# EAGLE design humanoid-18 (EAGLE 7.2.0)

## Sheet 1 of 10
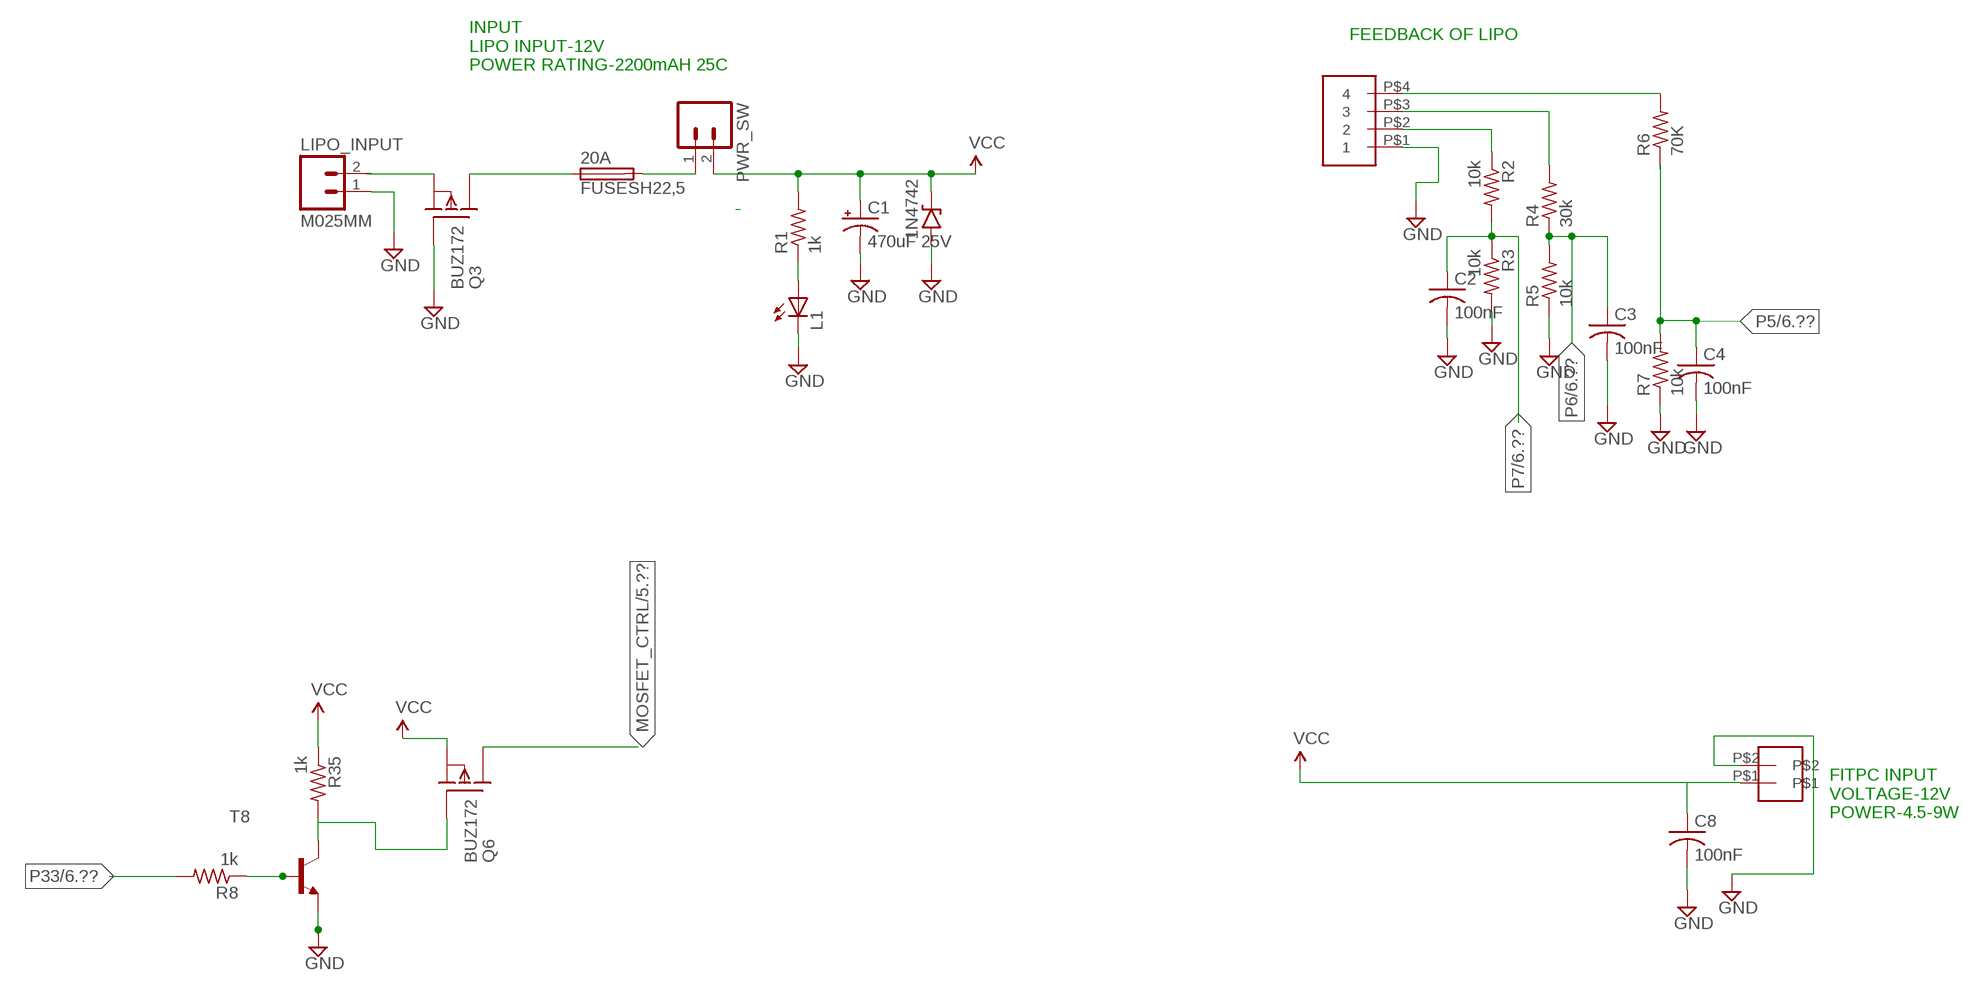
[diagram p0: schematic, sheet 1]

### Parts
1N4742  1N47XX3  [DO41-3]
20A  FUSESH22,5  [SH22,5]
C1  470uF 25V  CPOL-USG  [PANASONIC_G]
C2  100nF  C-USC1206  [C1206]
C3  100nF  C-USC1206  [C1206]
C4  100nF  C-USC1206  [C1206]
C8  100nF  C-USC1206  [C1206]
FITPC  2PINRIGHT  [2PINRIGHT]
L1  LEDCHIPLED_1206  [CHIPLED_1206]
LIPO_FB  4PINRIGHT  [4PINRIGHT]
LIPO_INPUT  M025MM  [SCREWTERMINAL-5MM-2]
PWR_SW  M02PTH  [1X02]
Q3  BUZ172  [TO220]
Q6  BUZ172  [TO220]
R1  1k  R-US_R0805  [R0805]
R2  10k  R-US_R0805  [R0805]
R3  10k  R-US_R0805  [R0805]
R4  30k  R-US_R0805  [R0805]
R5  10k  R-US_R0805  [R0805]
R6  70K  R-US_R0805  [R0805]
R7  10k  R-US_R0805  [R0805]
R8  1k  R-US_R0805  [R0805]
R35  1k  R-US_R0805  [R0805]
T8  MMBT2222ALT1-NPN-SOT23-BEC  [SOT23-BEC]

### Nets
GND: 1N4742.A C1.- C2.2 C3.2 C4.2 C8.2 FITPC.P$2 L1.C LIPO_FB.P$1 LIPO_INPUT.1 Q3.1(G) R3.2 R5.1 R7.1 ; also sheet 2,3,5,6,7,8,10
LIPO_FB4: LIPO_FB.P$4 R6.2
MOSFET_CTRL: Q6.2(D) ; also sheet 5
N$4: LIPO_FB.P$2 R2.1
N$9: 20A.2 PWR_SW.1
N$10: 20A.1 Q3.2(D)
N$18: LIPO_INPUT.2 Q3.3(S)
N$19: Q6.1(G) R35.2 T8.C
N$23: T8.E ; supply symbol labelled GND
N$28: R8.1 T8.B
N$338: LIPO_FB.P$3 R4.2
N$381: L1.A R1.1
P5: C4.1 R6.1 R7.2 ; also sheet 6
P6: C3.1 R4.1 R5.2 ; also sheet 6
P7: C2.1 R2.2 R3.1 ; also sheet 6
P33: R8.2 ; also sheet 6
VCC: 1N4742.C C1.+ C8.1 FITPC.P$1 PWR_SW.2 Q6.3(S) R1.2 R35.1 ; also sheet 3

### Notes on the sheet
- FEEDBACK OF LIPO
- INPUT
  LIPO INPUT-12V
  POWER RATING-2200mAH 25C
- FITPC INPUT
  VOLTAGE-12V
  POWER-4.5-9W

## Sheet 2 of 10
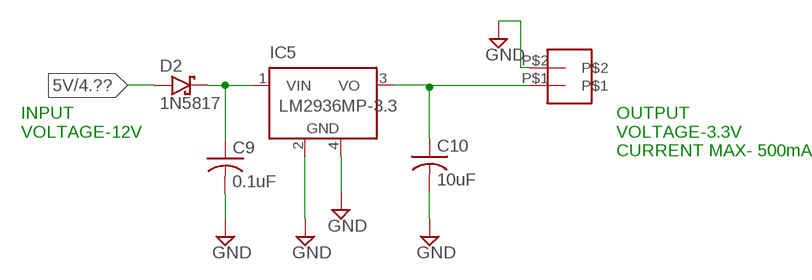
[diagram p1: schematic, sheet 2]

### Parts
3.3V1  2PINRIGHT  [2PINRIGHT]
C9  0.1uF  C-USC1206  [C1206]
C10  10uF  C-USC1206  [C1206]
D2  1N5817  [DO41-3]
IC5  LM2936MP-3.3  [SOT223]

### Nets
3.3V: 3.3V1.P$1 C10.1 IC5.3(VO) ; also sheet 4,6,7,10
5V: D2.A ; also sheet 3,4,6,7,8
GND: 3.3V1.P$2 C9.2 C10.2 IC5.2(GND) IC5.4(GND) ; also sheet 1,3,5,6,7,8,10
N$3: C9.1 D2.C IC5.1(VIN)

### Notes on the sheet
- INPUT
  VOLTAGE-12V
- OUTPUT
  VOLTAGE-3.3V
  CURRENT MAX- 500mA

## Sheet 3 of 10
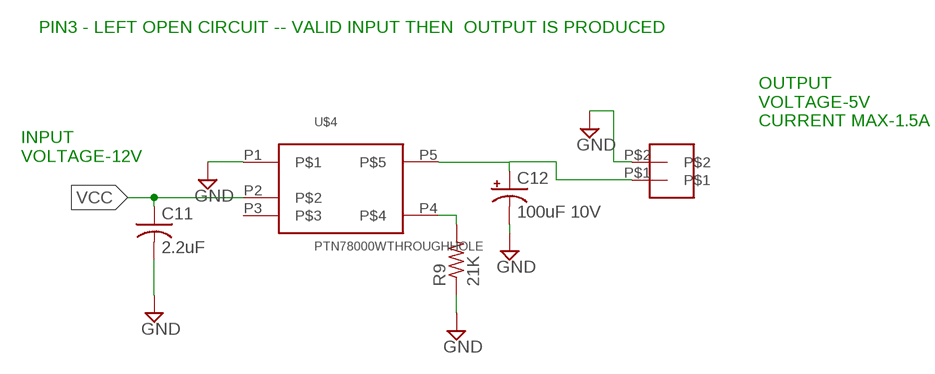
[diagram p2: schematic, sheet 3]

### Parts
5V1  2PINRIGHT  [2PINRIGHT]
C11  2.2uF  C-USC1206  [C1206]
C12  100uF 10V  CPOL-USC  [PANASONIC_C]
R9  21K  R-US_R0805  [R0805]
U$4  PTN78000WTHROUGHHOLE  [PTN78000W]

### Nets
5V: 5V1.P$1 C12.+ U$4.P5 ; also sheet 2,4,6,7,8
GND: 5V1.P$2 C11.2 C12.- R9.1 U$4.P1 ; also sheet 1,2,5,6,7,8,10
N$76: R9.2 U$4.P4
VCC: C11.1 U$4.P2 ; also sheet 1
Unconnected: U$4.P3

### Notes on the sheet
- PIN3 - LEFT OPEN CIRCUIT -- VALID INPUT THEN  OUTPUT IS PRODUCED
- OUTPUT
  VOLTAGE-5V
  CURRENT MAX-1.5A
- INPUT
  VOLTAGE-12V

## Sheet 4 of 10
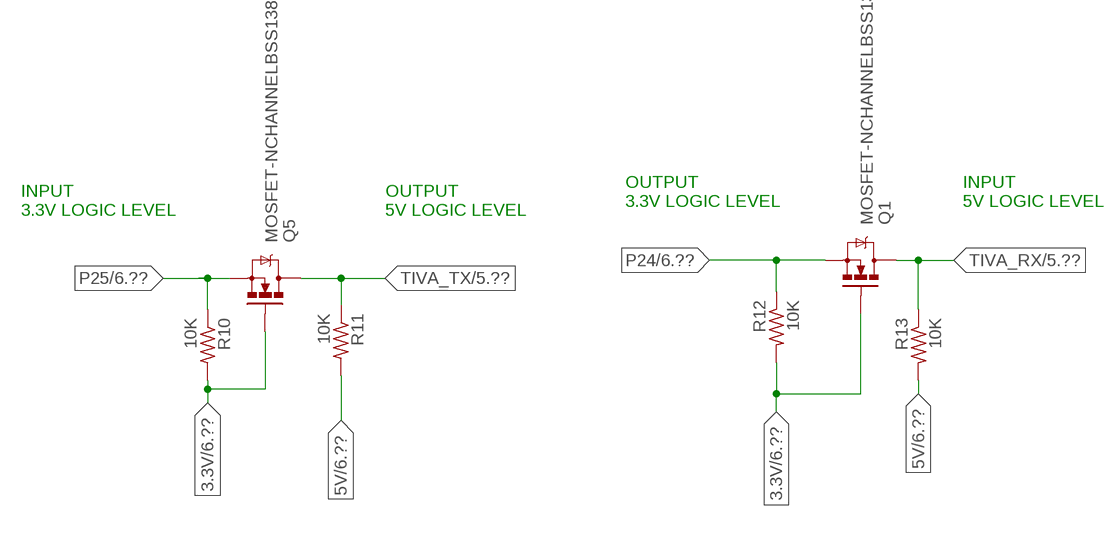
[diagram p3: schematic, sheet 4]

### Parts
Q1  MOSFET-NCHANNELBSS138  [SOT23]
Q5  MOSFET-NCHANNELBSS138  [SOT23]
R10  10K  R-US_R0805  [R0805]
R11  10K  R-US_R0805  [R0805]
R12  10K  R-US_R0805  [R0805]
R13  10K  R-US_R0805  [R0805]

### Nets
3.3V: Q1.1(G) Q5.1(G) R10.2 R12.2 ; also sheet 2,6,7,10
5V: R11.2 R13.2 ; also sheet 2,3,6,7,8
P24: Q1.2(S) R12.1 ; also sheet 6
P25: Q5.2(S) R10.1 ; also sheet 6
TIVA_RX: Q1.3(D) R13.1 ; also sheet 5
TIVA_TX: Q5.3(D) R11.1 ; also sheet 5

### Notes on the sheet
- OUTPUT
  3.3V LOGIC LEVEL
- INPUT
  5V LOGIC LEVEL
- INPUT
  3.3V LOGIC LEVEL
- OUTPUT
  5V LOGIC LEVEL

## Sheet 5 of 10
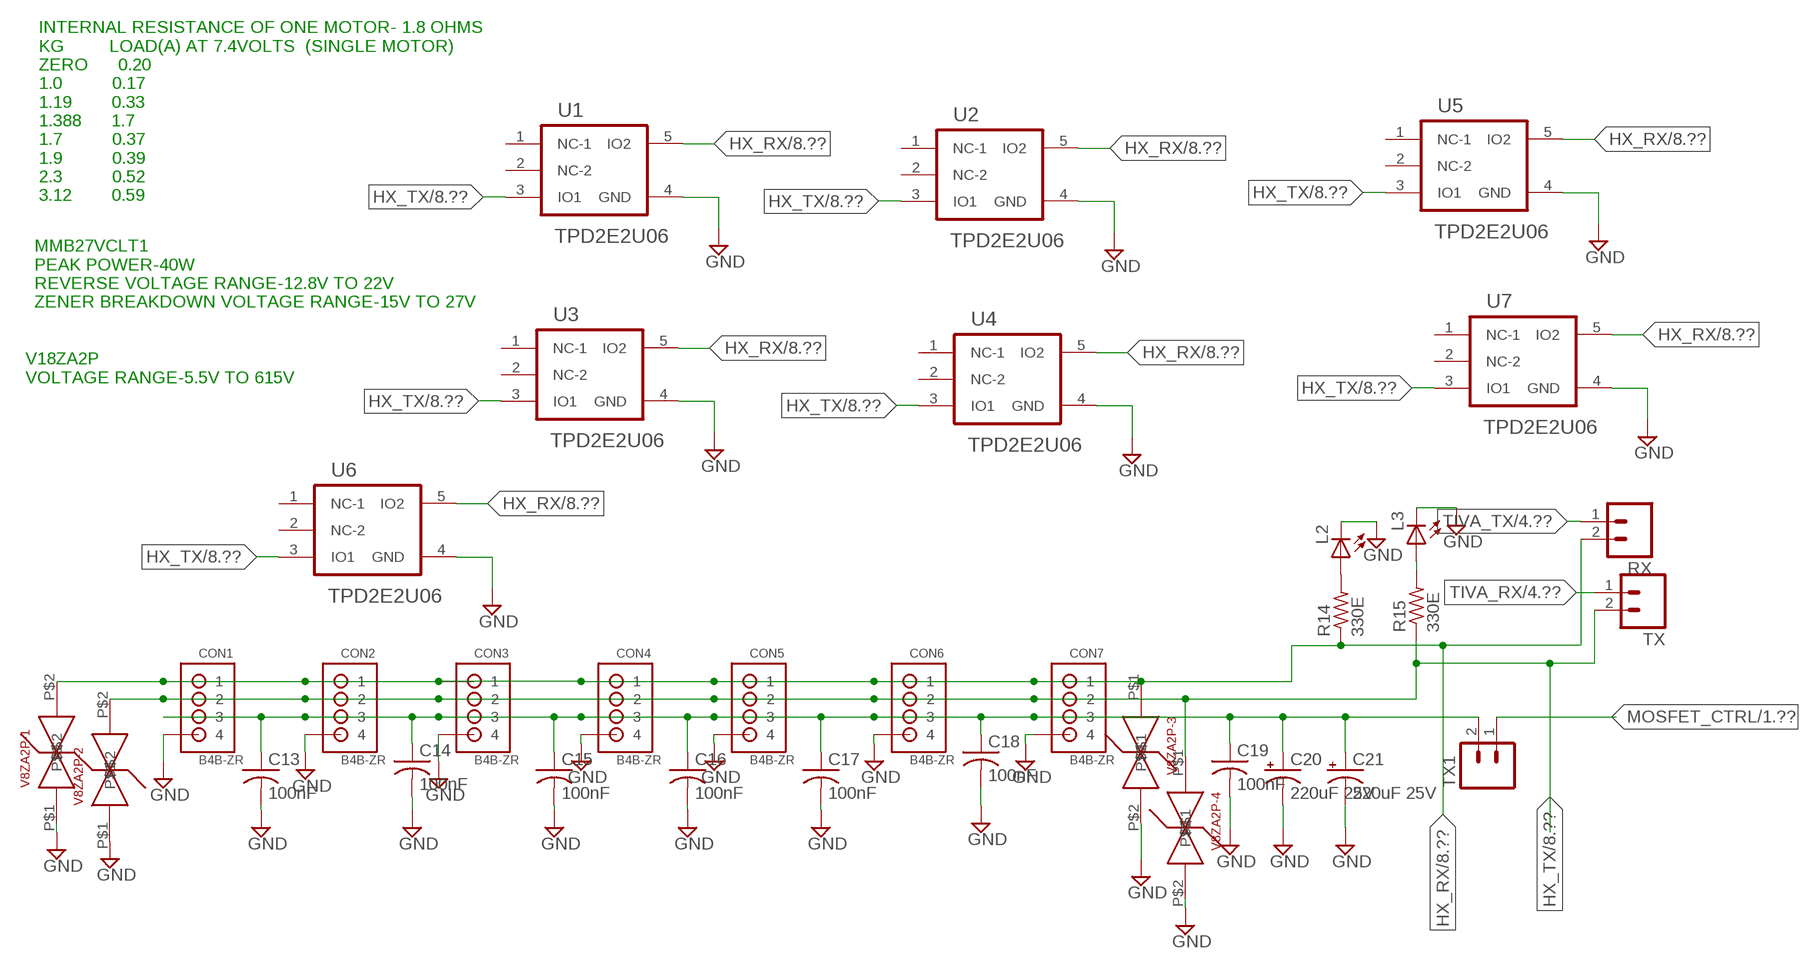
[diagram p4: schematic, sheet 5]

### Parts
C13  100nF  C-USC1206  [C1206]
C14  100nF  C-USC1206  [C1206]
C15  100nF  C-USC1206  [C1206]
C16  100nF  C-USC1206  [C1206]
C17  100nF  C-USC1206  [C1206]
C18  100nF  C-USC1206  [C1206]
C19  100nF  C-USC1206  [C1206]
C20  220uF 25V  CPOL-USE  [PANASONIC_E]
C21  220uF 25V  CPOL-USE  [PANASONIC_E]
CON1  B4B-ZR  [B4B-ZR]
CON2  B4B-ZR  [B4B-ZR]
CON3  B4B-ZR  [B4B-ZR]
CON4  B4B-ZR  [B4B-ZR]
CON5  B4B-ZR  [B4B-ZR]
CON6  B4B-ZR  [B4B-ZR]
CON7  B4B-ZR  [B4B-ZR]
L2  LEDCHIPLED_1206  [CHIPLED_1206]
L3  LEDCHIPLED_1206  [CHIPLED_1206]
R14  330E  R-US_R0805  [R0805]
R15  330E  R-US_R0805  [R0805]
RX  M02PTH  [1X02]
TX  M02PTH  [1X02]
TX1  M02PTH  [1X02]
U1  TPD2E2U06  [SOT50P160X60-5N]
U2  TPD2E2U06  [SOT50P160X60-5N]
U3  TPD2E2U06  [SOT50P160X60-5N]
U4  TPD2E2U06  [SOT50P160X60-5N]
U5  TPD2E2U06  [SOT50P160X60-5N]
U6  TPD2E2U06  [SOT50P160X60-5N]
U7  TPD2E2U06  [SOT50P160X60-5N]
V8ZA2P-1  V18ZA2P  [V18ZA2P]
V8ZA2P-2  V18ZA2P  [V18ZA2P]
V8ZA2P-3  V18ZA2P  [V18ZA2P]
V8ZA2P-4  V18ZA2P  [V18ZA2P]

### Nets
GND: C13.2 C14.2 C15.2 C16.2 C17.2 C18.2 C19.2 C20.- C21.- CON1.4 CON2.4 CON3.4 CON4.4 CON5.4 CON6.4 CON7.4 L2.C L3.C U1.4(GND) U2.4(GND) U3.4(GND) U4.4(GND) U5.4(GND) U6.4(GND) U7.4(GND) V8ZA2P-1.P$1 V8ZA2P-2.P$1 V8ZA2P-3.P$2 V8ZA2P-4.P$2 ; also sheet 1,2,3,6,7,8,10
HX_RX: CON1.1 CON2.1 CON3.1 CON4.1 CON5.1 CON6.1 CON7.1 R14.1 RX.2 U1.5(IO2) U2.5(IO2) U3.5(IO2) U4.5(IO2) U5.5(IO2) U6.5(IO2) U7.5(IO2) V8ZA2P-1.P$2 V8ZA2P-3.P$1 ; also sheet 8
HX_TX: CON1.2 CON2.2 CON3.2 CON4.2 CON5.2 CON6.2 CON7.2 R15.1 TX.2 U1.3(IO1) U2.3(IO1) U3.3(IO1) U4.3(IO1) U5.3(IO1) U6.3(IO1) U7.3(IO1) V8ZA2P-2.P$2 V8ZA2P-4.P$1 ; also sheet 8
MOSFET_CTRL: TX1.1 ; also sheet 1
MOSFET_CTRL1: C13.1 C14.1 C15.1 C16.1 C17.1 C18.1 C19.1 C20.+ C21.+ CON1.3 CON2.3 CON3.3 CON4.3 CON5.3 CON6.3 CON7.3 TX1.2
N$73: L2.A R14.2
N$74: L3.A R15.2
TIVA_RX: TX.1 ; also sheet 4
TIVA_TX: RX.1 ; also sheet 4
Unconnected: U1.1(NC-1) U1.2(NC-2) U2.1(NC-1) U2.2(NC-2) U3.1(NC-1) U3.2(NC-2) U4.1(NC-1) U4.2(NC-2) U5.1(NC-1) U5.2(NC-2) U6.1(NC-1) U6.2(NC-2) U7.1(NC-1) U7.2(NC-2)

### Notes on the sheet
- INTERNAL RESISTANCE OF ONE MOTOR- 1.8 OHMS
  KG         LOAD(A) AT 7.4VOLTS  (SINGLE MOTOR)
  ZERO      0.20
  1.0          0.17
  1.19        0.33
  1.388      1.7
  1.7          0.37
  1.9          0.39
  2.3          0.52
  3.12        0.59
- MMB27VCLT1
  PEAK POWER-40W
  REVERSE VOLTAGE RANGE-12.8V TO 22V
  ZENER BREAKDOWN VOLTAGE RANGE-15V TO 27V
- V18ZA2P
  VOLTAGE RANGE-5.5V TO 615V

## Sheet 6 of 10
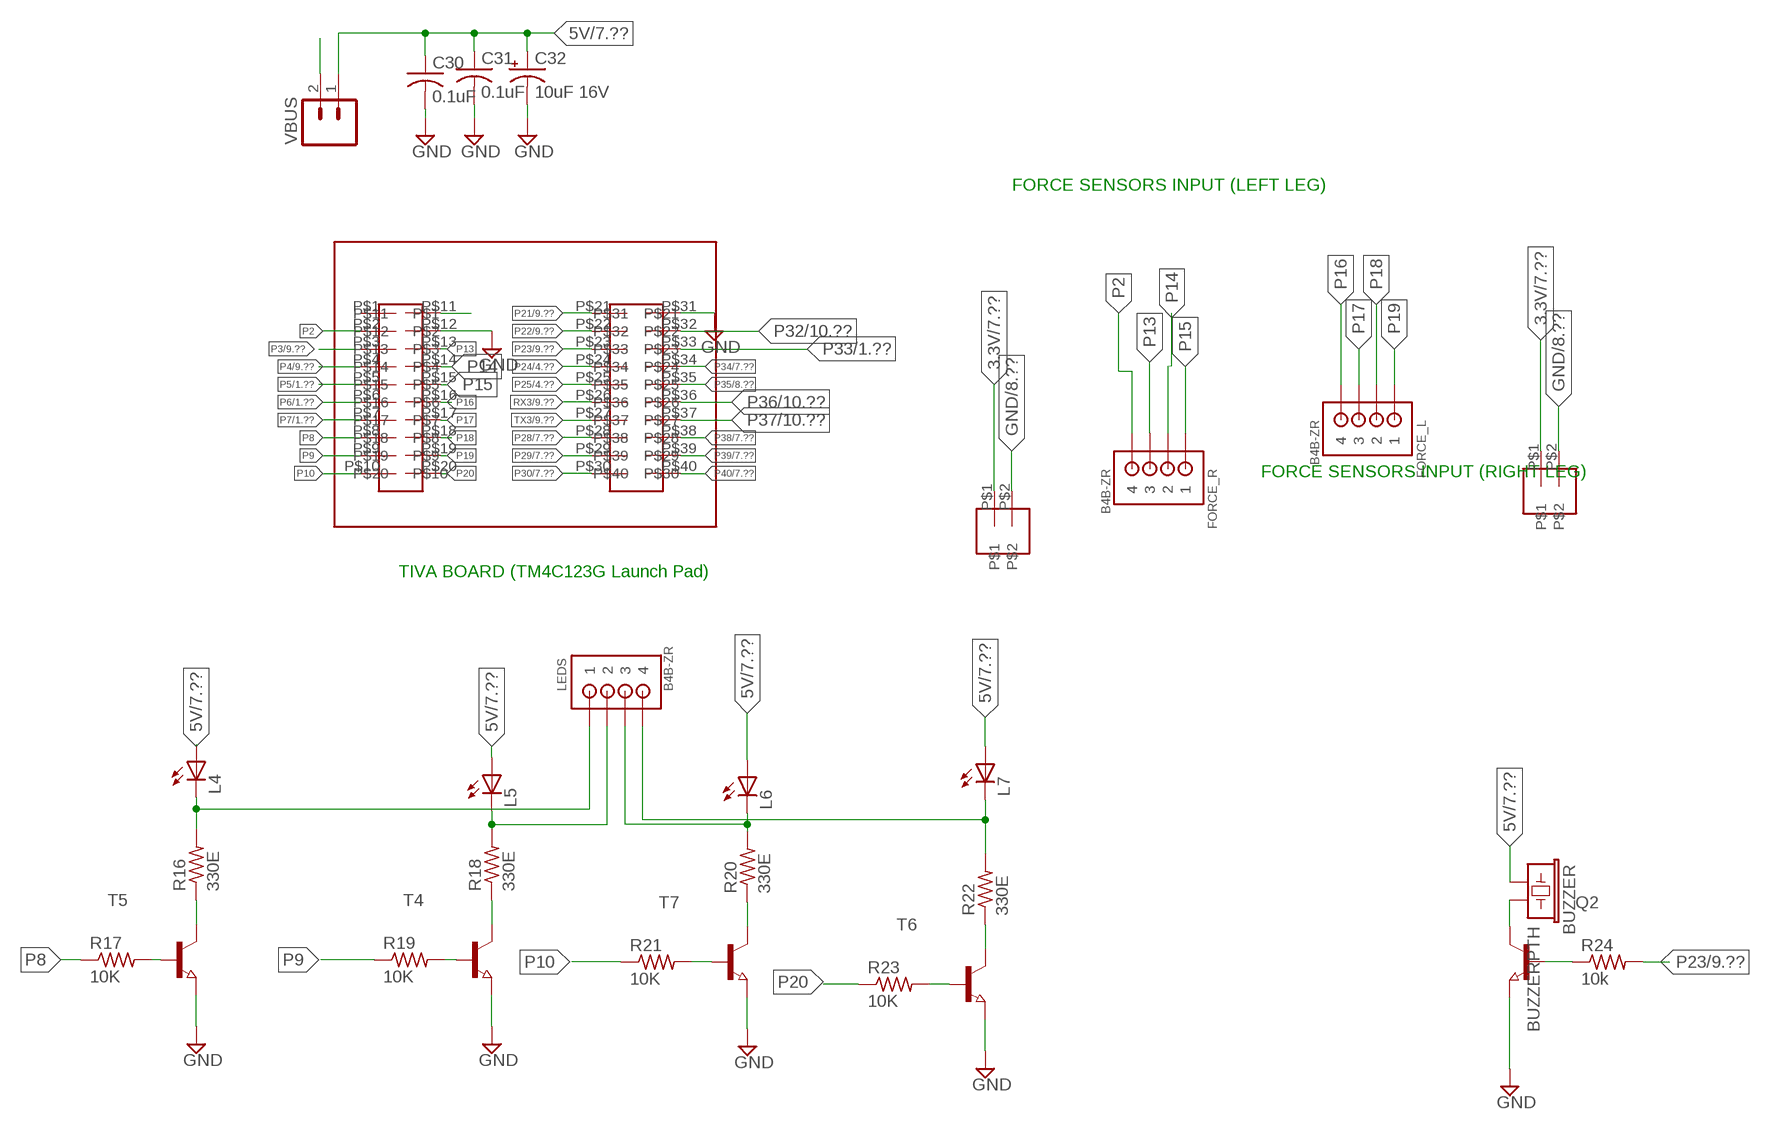
[diagram p5: schematic, sheet 6]

### Parts
3.3VL  2PINRIGHT  [2PINRIGHT]
3.3VR  2PINRIGHT  [2PINRIGHT]
BUZZER  BUZZERPTH  [BUZZER-12MM]
C30  0.1uF  C-USC1206  [C1206]
C31  0.1uF  C-USC1206  [C1206]
C32  10uF 16V  CPOL-USA  [PANASONIC_A]
FORCE_L  B4B-ZR  [B4B-ZR]
FORCE_R  B4B-ZR  [B4B-ZR]
L4  LEDCHIPLED_1206  [CHIPLED_1206]
L5  LEDCHIPLED_1206  [CHIPLED_1206]
L6  LEDCHIPLED_1206  [CHIPLED_1206]
L7  LEDCHIPLED_1206  [CHIPLED_1206]
LEDS  B4B-ZR  [B4B-ZR]
Q2  NPN-TRANSISTOR_SOT23  [SOT23]
R16  330E  R-US_R0805  [R0805]
R17  10K  R-US_R0805  [R0805]
R18  330E  R-US_R0805  [R0805]
R19  10K  R-US_R0805  [R0805]
R20  330E  R-US_R0805  [R0805]
R21  10K  R-US_R0805  [R0805]
R22  330E  R-US_R0805  [R0805]
R23  10K  R-US_R0805  [R0805]
R24  10k  R-US_R0805  [R0805]
T4  NPN-TRANSISTOR_SOT23  [SOT23]
T5  NPN-TRANSISTOR_SOT23  [SOT23]
T6  NPN-TRANSISTOR_SOT23  [SOT23]
T7  NPN-TRANSISTOR_SOT23  [SOT23]
U$1  TIVA  [TIVA]
VBUS  M02PTH  [1X02]

### Nets
3.3V: 3.3VL.P$1 3.3VR.P$1 ; also sheet 2,4,7,10
5V: BUZZER.+ C30.1 C31.1 C32.+ L4.A L5.A L6.A L7.A VBUS.1 ; also sheet 2,3,4,7,8
5VJ: U$1.P$11 VBUS.2
GND: 3.3VL.P$2 3.3VR.P$2 C30.2 C31.2 C32.- Q2.2(E) T4.2(E) T5.2(E) T6.2(E) T7.2(E) U$1.P$12 U$1.P$31 ; also sheet 1,2,3,5,7,8,10
N$20: BUZZER.- Q2.3(C)
N$21: Q2.1(B) R24.1
N$22: R19.2 T4.1(B)
N$24: L5.C LEDS.2 R18.2
N$25: R18.1 T4.3(C)
N$26: R17.2 T5.1(B)
N$32: L4.C LEDS.1 R16.2
N$33: R16.1 T5.3(C)
N$36: R23.2 T6.1(B)
N$40: L7.C LEDS.4 R22.2
N$41: R22.1 T6.3(C)
N$42: R21.2 T7.1(B)
N$43: L6.C LEDS.3 R20.2
N$44: R20.1 T7.3(C)
P2: FORCE_R.4 U$1.P$2
P3: U$1.P$3 ; also sheet 9
P4: U$1.P$4 ; also sheet 9
P5: U$1.P$5 ; also sheet 1
P6: U$1.P$6 ; also sheet 1
P7: U$1.P$7 ; also sheet 1
P8: R17.1 U$1.P$8
P9: R19.1 U$1.P$9
P10: R21.1 U$1.P$10
P13: FORCE_R.3 U$1.P$13
P14: FORCE_R.2 U$1.P$14
P15: FORCE_R.1 U$1.P$15
P16: FORCE_L.4 U$1.P$16
P17: FORCE_L.3 U$1.P$17
P18: FORCE_L.2 U$1.P$18
P19: FORCE_L.1 U$1.P$19
P20: R23.1 U$1.P$20
P21: U$1.P$21 ; also sheet 9
P22: U$1.P$22 ; also sheet 9
P23: R24.2 U$1.P$23 ; also sheet 9
P24: U$1.P$24 ; also sheet 4
P25: U$1.P$25 ; also sheet 4
P28: U$1.P$28 ; also sheet 7
P29: U$1.P$29 ; also sheet 7
P30: U$1.P$30 ; also sheet 7
P32: U$1.P$32 ; also sheet 10
P33: U$1.P$33 ; also sheet 1
P34: U$1.P$34 ; also sheet 7
P35: U$1.P$35 ; also sheet 8
P36: U$1.P$36 ; also sheet 10
P37: U$1.P$37 ; also sheet 10
P38: U$1.P$38 ; also sheet 7
P39: U$1.P$39 ; also sheet 7
P40: U$1.P$40 ; also sheet 7
RX3: U$1.P$26 ; also sheet 9
TX3: U$1.P$27 ; also sheet 9
Unconnected: U$1.P$1

### Notes on the sheet
- FORCE SENSORS INPUT (LEFT LEG)
- FORCE SENSORS INPUT (RIGHT LEG)
- TIVA BOARD (TM4C123G Launch Pad)

## Sheet 7 of 10
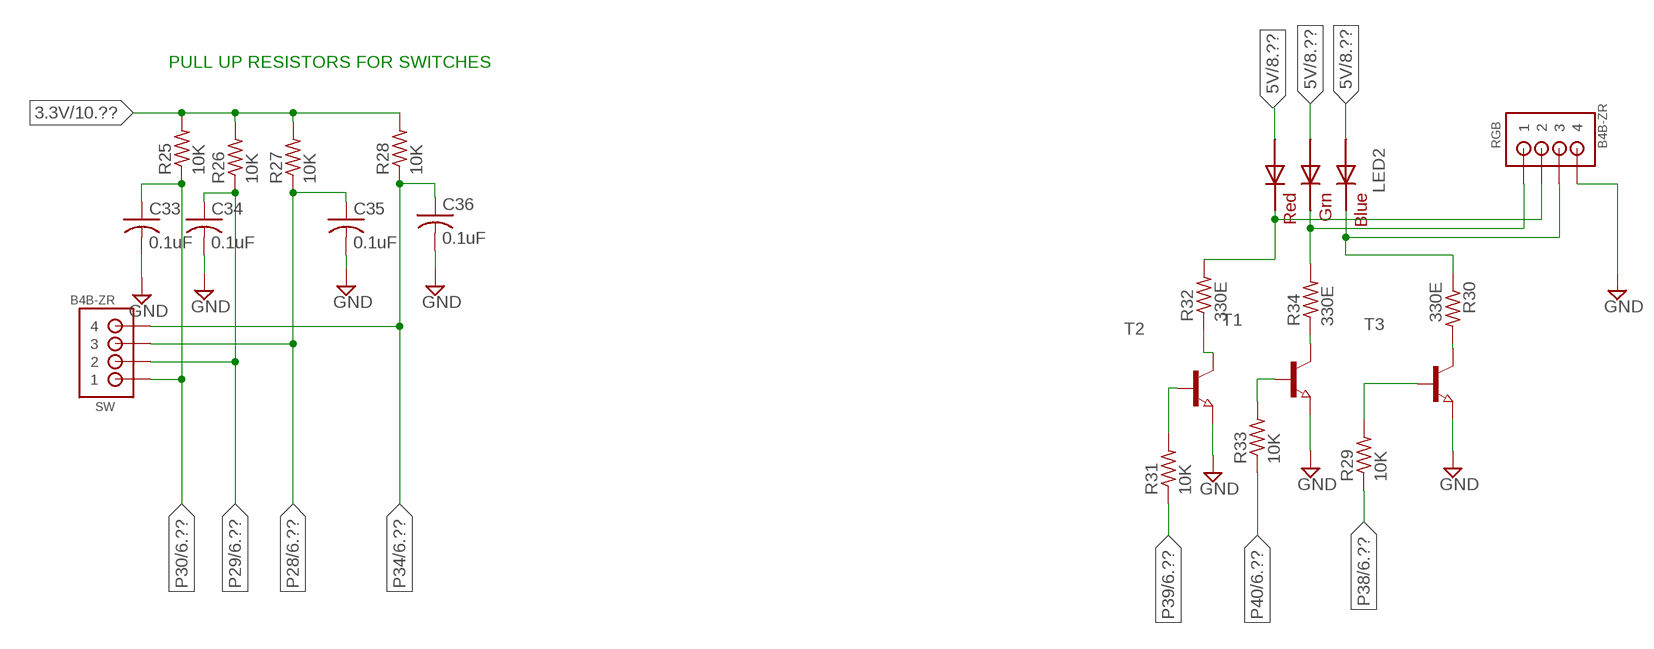
[diagram p6: schematic, sheet 7]

### Parts
C33  0.1uF  C-USC1206  [C1206]
C34  0.1uF  C-USC1206  [C1206]
C35  0.1uF  C-USC1206  [C1206]
C36  0.1uF  C-USC1206  [C1206]
LED2  RGBLED5050  [RGBLED5050]
R25  10K  R-US_R0805  [R0805]
R26  10K  R-US_R0805  [R0805]
R27  10K  R-US_R0805  [R0805]
R28  10K  R-US_R0805  [R0805]
R29  10K  R-US_R0805  [R0805]
R30  330E  R-US_R0805  [R0805]
R31  10K  R-US_R0805  [R0805]
R32  330E  R-US_R0805  [R0805]
R33  10K  R-US_R0805  [R0805]
R34  330E  R-US_R0805  [R0805]
RGB  B4B-ZR  [B4B-ZR]
SW  B4B-ZR  [B4B-ZR]
T1  NPN-TRANSISTOR_SOT23  [SOT23]
T2  NPN-TRANSISTOR_SOT23  [SOT23]
T3  NPN-TRANSISTOR_SOT23  [SOT23]

### Nets
3.3V: R25.2 R26.2 R27.2 R28.2 ; also sheet 2,4,6,10
5V: LED2.1(GREEN_A) LED2.2(RED_A) LED2.3(BLUE_A) ; also sheet 2,3,4,6,8
GND: C33.2 C34.2 C35.2 C36.2 RGB.4 T1.2(E) T2.2(E) T3.2(E) ; also sheet 1,2,3,5,6,8,10
N$1: LED2.4(BLUE_C) R30.1 RGB.3
N$5: LED2.5(RED_C) R32.2 RGB.2
N$27: LED2.6(GREEN_C) R34.2 RGB.1
N$29: R30.2 T3.3(C)
N$30: R32.1 T2.3(C)
N$31: R34.1 T1.3(C)
N$37: R29.2 T3.1(B)
N$38: R31.2 T2.1(B)
N$39: R33.2 T1.1(B)
P28: C35.1 R27.1 SW.3 ; also sheet 6
P29: C34.1 R26.1 SW.2 ; also sheet 6
P30: C33.1 R25.1 SW.1 ; also sheet 6
P34: C36.1 R28.1 SW.4 ; also sheet 6
P38: R29.1 ; also sheet 6
P39: R31.1 ; also sheet 6
P40: R33.1 ; also sheet 6

### Notes on the sheet
- PULL UP RESISTORS FOR SWITCHES

## Sheet 8 of 10
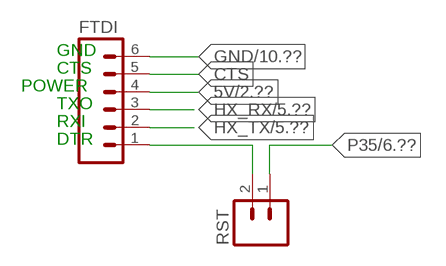
[diagram p7: schematic, sheet 8]

### Parts
FTDI  M06LOCK  [1X06_LOCK]
RST  M02PTH  [1X02]

### Nets
5V: FTDI.4 ; also sheet 2,3,4,6,7
CTS: FTDI.5
GND: FTDI.6 ; also sheet 1,2,3,5,6,7,10
HX_RX: FTDI.3 ; also sheet 5
HX_TX: FTDI.2 ; also sheet 5
N$2: FTDI.1 RST.2
P35: RST.1 ; also sheet 6

### Notes on the sheet
- GND
- CTS
- POWER
- TXO
- RXI
- DTR

## Sheet 9 of 10
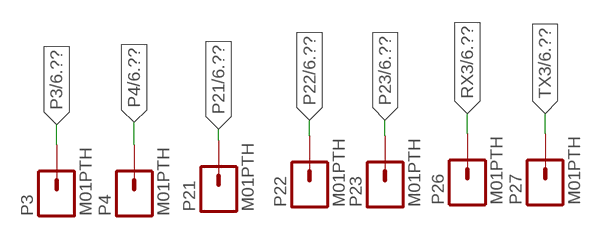
[diagram p8: schematic, sheet 9]

### Parts
P3  M01PTH  [1X01]
P4  M01PTH  [1X01]
P21  M01PTH  [1X01]
P22  M01PTH  [1X01]
P23  M01PTH  [1X01]
P26  M01PTH  [1X01]
P27  M01PTH  [1X01]

### Nets
P3: P3.1 ; also sheet 6
P4: P4.1 ; also sheet 6
P21: P21.1 ; also sheet 6
P22: P22.1 ; also sheet 6
P23: P23.1 ; also sheet 6
RX3: P26.1 ; also sheet 6
TX3: P27.1 ; also sheet 6

## Sheet 10 of 10
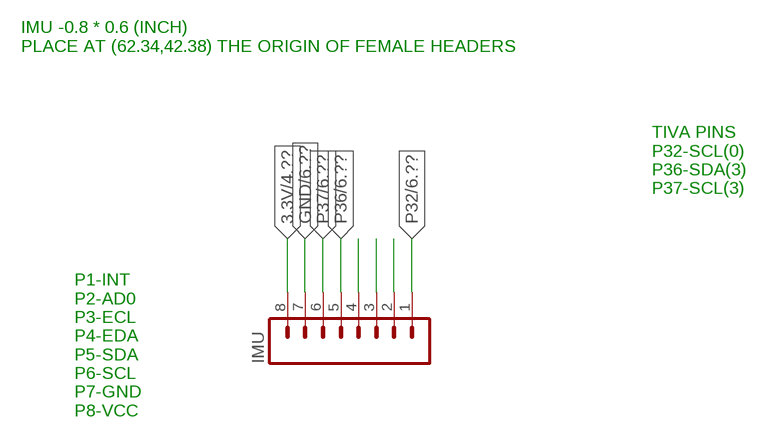
[diagram p9: schematic, sheet 10]

### Parts
IMU  M081X08  [1X08]

### Nets
3.3V: IMU.8 ; also sheet 2,4,6,7
GND: IMU.7 ; also sheet 1,2,3,5,6,7,8
N$12: IMU.4
N$13: IMU.3
N$15: IMU.2
P32: IMU.1 ; also sheet 6
P36: IMU.5 ; also sheet 6
P37: IMU.6 ; also sheet 6

### Notes on the sheet
- IMU -0.8 * 0.6 (INCH)
  PLACE AT (62.34,42.38) THE ORIGIN OF FEMALE HEADERS
- TIVA PINS
  P32-SCL(0)
  P36-SDA(3)
  P37-SCL(3)
- P1-INT
  P2-AD0
  P3-ECL
  P4-EDA
  P5-SDA
  P6-SCL
  P7-GND
  P8-VCC

## Library data of the parts
1N4742 = gm-diodes:1N47XX: Zener Diode 1N4728 - 1N4764: 3.3 V - 100V, 10% (1n47xxA 5%); DO-41 glass case; OC_NEWARK: unknown
3.3V1 5V1 FITPC = jst 2.5mm:2PINRIGHT; OC_NEWARK: unknown
3.3VL 3.3VR = jst 2.5mm:2PINRIGHT
20A = fuse:FUSE: Fuse; OC_FARNELL: unknown; OC_NEWARK: unknown
BUZZER = SparkFun-Electromechanical:BUZZER: Buzzer 12mm Spark Fun Electronics SKU : Comp-Buzzer
C1 = resistor:CPOL-US: POLARIZED CAPACITOR, American symbol; MANUFACTURER: PANASONIC ELECTRONIC COMPONENTS; OC_NEWARK: unknown; PARTNO: EEEFK1E471AP
C2-C4 C8-C10 C13-C19 = adafruit:C-US: CAPACITOR, American symbol; MANUFACTURER: KEMET; OC_NEWARK: unknown; PARTNO: C1206C104K5RACTU
C11 = resistor:C-US: CAPACITOR, American symbol; MANUFACTURER: TDK; MOUSER_PARTNO: 810-C1608X7R1A225K; PARTNO: C1608X7R1A225K080AC; SELLER: MOUSER
C12 = resistor:CPOL-US: POLARIZED CAPACITOR, American symbol; MANUFACTURER: Panasonic; MOUSER_PARTNO: 667-EEE-HA1A101P; OC_NEWARK: unknown; PARTNO: EEE-HA1A101P; SELLER: MOUSER ELECTRONICS
C20 C21 = resistor:CPOL-US: POLARIZED CAPACITOR, American symbol; MANUFACTURER: PANASONIC ELECTRONIC COMPONENTS; MOUSER_PARTNO: 667-EEE-1EA221P; OC_NEWARK: unknown; PARTNO: EEE-1EA221P; SELLER: MOUSER ELECTRONICS
C30 C31 = resistor:C-US: CAPACITOR, American symbol
C32 = resistor:CPOL-US: POLARIZED CAPACITOR, American symbol
C33-C36 = adafruit:C-US: CAPACITOR, American symbol; MANUFACTURER: Kemet; MOUSER_PARTNO: 80-C0805C104M5R; OC_NEWARK: unknown; PARTNO: C0805C104M5RACTU; SELLER: MOUSER
CON1-CON7 = jst_herkulex:B4B-ZR: JST-ZH Connector 4 pol, 1.5mm pitch Package: B4B-ZR Source: http://www.jst-mfg.com/product/pdf/eng/eZH.pdf; MF: FARNELL; MPN: B4B-ZR(LF)(SN); OC_NEWARK: unknown
D2 = gm-diodes:1N5817; OC_NEWARK: unknown
FORCE_L FORCE_R LEDS RGB SW = jst_herkulex:B4B-ZR: JST-ZH Connector 4 pol, 1.5mm pitch Package: B4B-ZR Source: http://www.jst-mfg.com/product/pdf/eng/eZH.pdf
FTDI = SparkFun-Connectors:M06: Header 6 Standard 6-pin 0.1" header. Use with straight break away headers (SKU : PRT-00116), right angle break away headers (PRT-00553), swiss pins (PRT-00743), machine pins (PRT-00117), and female headers (PRT-00115). Molex polarized connector foot print use with SKU : PRT-08094 with associated crimp pins and housings. NOTES ON THE VARIANTS LOCK and LOCK_LONGPADS... This footprint was designed to help hold the alignment of a through-hole component (i.e. 6-pin header) while soldering it into place. You may notice that each hole has been shifted either up or down by 0.005 of an inch from it's more standard position (which is a perfectly straight line). This slight alteration caused the pins (the squares in the middle) to touch the edges of the holes. Because they are alternating, it causes a "brace" to hold the component in place. 0.005 has proven to be the perfect amount of "off-center" position when using our standard breakaway headers. Although looks a little odd when you look at the bare footprint, once you have a header in there, the alteration is very hard to notice. Also,if you push a header all the way into place, it is covered up entirely on the bottom side. This idea of altering the position of holes to aid alignment will be further integrated into the Sparkfun Library for other footprints. It can help hold any component with 3 or more connection pins.
IC5 = national-semiconductor:LM2936MP?*: Ultra-Low Quiescent Current LDO Voltage Regulator Source: Data sheet <http://www.national.com/ds/LM/LM2936.pdf>; MF: NATIONAL SEMICONDUCTOR; MPN: LM2936MP-3.3/NOPB; OC_FARNELL: 1469062; OC_NEWARK: unknown
IMU = SparkFun-Connectors:M08: Header 8 Standard 8-pin 0.1" header. Use with straight break away headers (SKU : PRT-00116), right angle break away headers (PRT-00553), swiss pins (PRT-00743), machine pins (PRT-00117), and female headers (PRT-00115).
L1-L7 = adafruit:LED: LED OSRAM: - CHIPLED LG R971, LG N971, LY N971, LG Q971, LY Q971, LO R971, LY R971 LH N974, LH R974 LS Q976, LO Q976, LY Q976 LO Q996 - Hyper CHIPLED LW Q18S LB Q993, LB Q99A, LB R99A - SideLED LS A670, LO A670, LY A670, LG A670, LP A670 LB A673, LV A673, LT A673, LW A673 LH A674 LY A675 LS A676, LA A676, LO A676, LY A676, LW A676 LS A679, LY A679, LG A679 - Hyper Micro SIDELED® LS Y876, LA Y876, LO Y876, LY Y876 LT Y87S - SmartLED LW L88C, LW L88S LB L89C, LB L89S, LG L890 LS L89K, LO L89K, LY L89K LS L896, LA L896, LO L896, LY L896 - TOPLED LS T670, LO T670, LY T670, LG T670, LP T670 LSG T670, LSP T670, LSY T670, LOP T670, LYG T670 LG T671, LOG T671, LSG T671 LB T673, LV T673, LT T673, LW T673 LH T674 LS T676, LA T676, LO T676, LY T676, LB T676, LH T676, LSB T676, LW T676 LB T67C, LV T67C, LT T67C, LS T67K, LO T67K, LY T67K, LW E67C LS E67B, LA E67B, LO E67B, LY E67B, LB E67C, LV E67C, LT E67C LW T67C LS T679, LY T679, LG T679 LS T770, LO T770, LY T770, LG T770, LP T770 LB T773, LV T773, LT T773, LW T773 LH T774 LS E675, LA E675, LY E675, LS T675 LS T776, LA T776, LO T776, LY T776, LB T776 LHGB T686 LT T68C, LB T68C - Hyper Mini TOPLED® LB M676 - Mini TOPLED Santana® LG M470 LS M47K, LO M47K, LY M47K Source: http://www.osram.convergy.de/; OC_NEWARK: unknown
LED2 = adafruit:RGBLED: For 5050 RGB LEDs, the order of the LEDs may vary from one manufacturer to another!; OC_NEWARK: unknown
LIPO_FB = jst 2.5mm:4PINRIGHT
LIPO_INPUT = SparkFun-Connectors:M02: Standard 2-pin 0.1" header. Use with - straight break away headers ( PRT-00116) - right angle break away headers (PRT-00553) - swiss pins (PRT-00743) - machine pins (PRT-00117) - female headers (PRT-00115) Molex polarized connector foot print use with: PRT-08233 with associated crimp pins and housings. 2.54_SCREWTERM for use with PRT-10571. 3.5mm Screw Terminal footprints for PRT-08084 5mm Screw Terminal footprints for use with PRT-08433; OC_NEWARK: unknown
P3 P4 P21-P23 P26 P27 = SparkFun-Connectors:M01: Header 1 Standard 1-pin 0.1" header. Use with straight break away headers (SKU : PRT-00116), right angle break away headers (PRT-00553), swiss pins (PRT-00743), machine pins (PRT-00117), and female headers (PRT-00115).
PWR_SW RST RX TX TX1 VBUS = SparkFun:M02: Header 2 Standard 2-pin 0.1" header. Use with straight break away headers (SKU : PRT-00116), right angle break away headers (PRT-00553), swiss pins (PRT-00743), machine pins (PRT-00117), and female headers (PRT-00115). Molex polarized connector foot print use with SKU : PRT-08233 with associated crimp pins and housings.; OC_NEWARK: unknown
Q1 Q5 = SparkFun-DiscreteSemi:MOSFET-NCHANNEL: Common NMOSFET Parts MFG P/N Store ID Prod ID FDD8780 TRANS-09984 SI7820DN TRANS-11055 FDS6630A IC-08089 2N7002PW TRANS-11151 FQP30N06L COM-10213 TRANS-10060 BSS123LT1G TRANS-08345 BSS138 TRANS-00830 BS170 2N7000; OC_NEWARK: unknown; PROD_ID: TRANS-00830
Q2 = semicon-smd-ipc:NPN-TRANSISTOR_: NPN TRANSISTOR
Q3 Q6 = transistor-fet:BUZ172: P-Channel Enhancement MOSFET -100V; -5A; 0,8Ohm
R1-R23 R25-R35 = resistor:R-US_: RESISTOR, American symbol; OC_NEWARK: unknown
R24 = resistor:R-US_: RESISTOR, American symbol
T1-T7 = semicon-smd-ipc:NPN-TRANSISTOR_: NPN TRANSISTOR; OC_NEWARK: unknown
T8 = transistor-neu-to92:*-NPN-: NPN Transistror
U1-U7 = ti_tpd2e2u06:TPD2E2U06: LOW-CAPACITANCE 2-CHANNEL ±15-kV ESD-PROTECTION ARRAY; MPN: TPD2E001IDRLRQ1; OC_FARNELL: -; OC_NEWARK: 55R7553; PACKAGE: SOT-23-5; SUPPLIER: Texas Instruments
U$1 = tiva:TIVA; OC_NEWARK: unknown
U$4 = PTN78000W:PTN78000W
V8ZA2P-1-V8ZA2P-4 = SparkFun-DiscreteSemi:V18ZA2P: Varistor; OC_NEWARK: unknown

## Net classes
0 default: width 0.35 mm

## Board
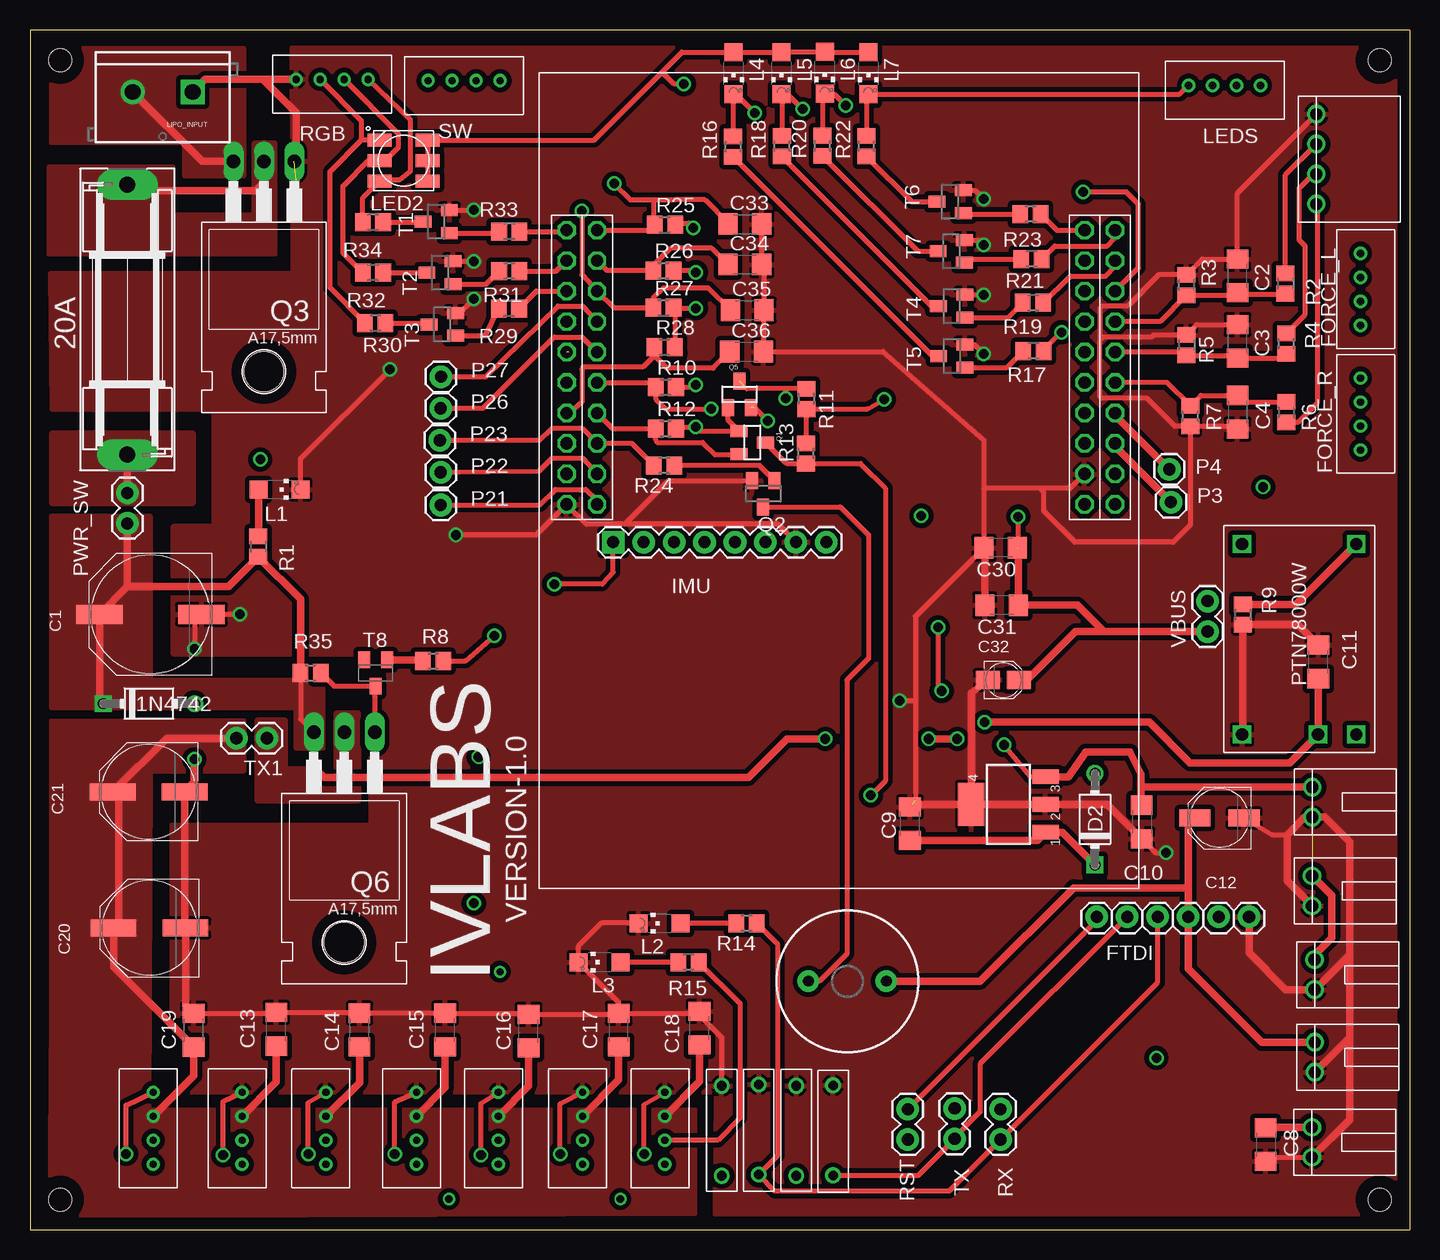
[diagram p10: board, top side]
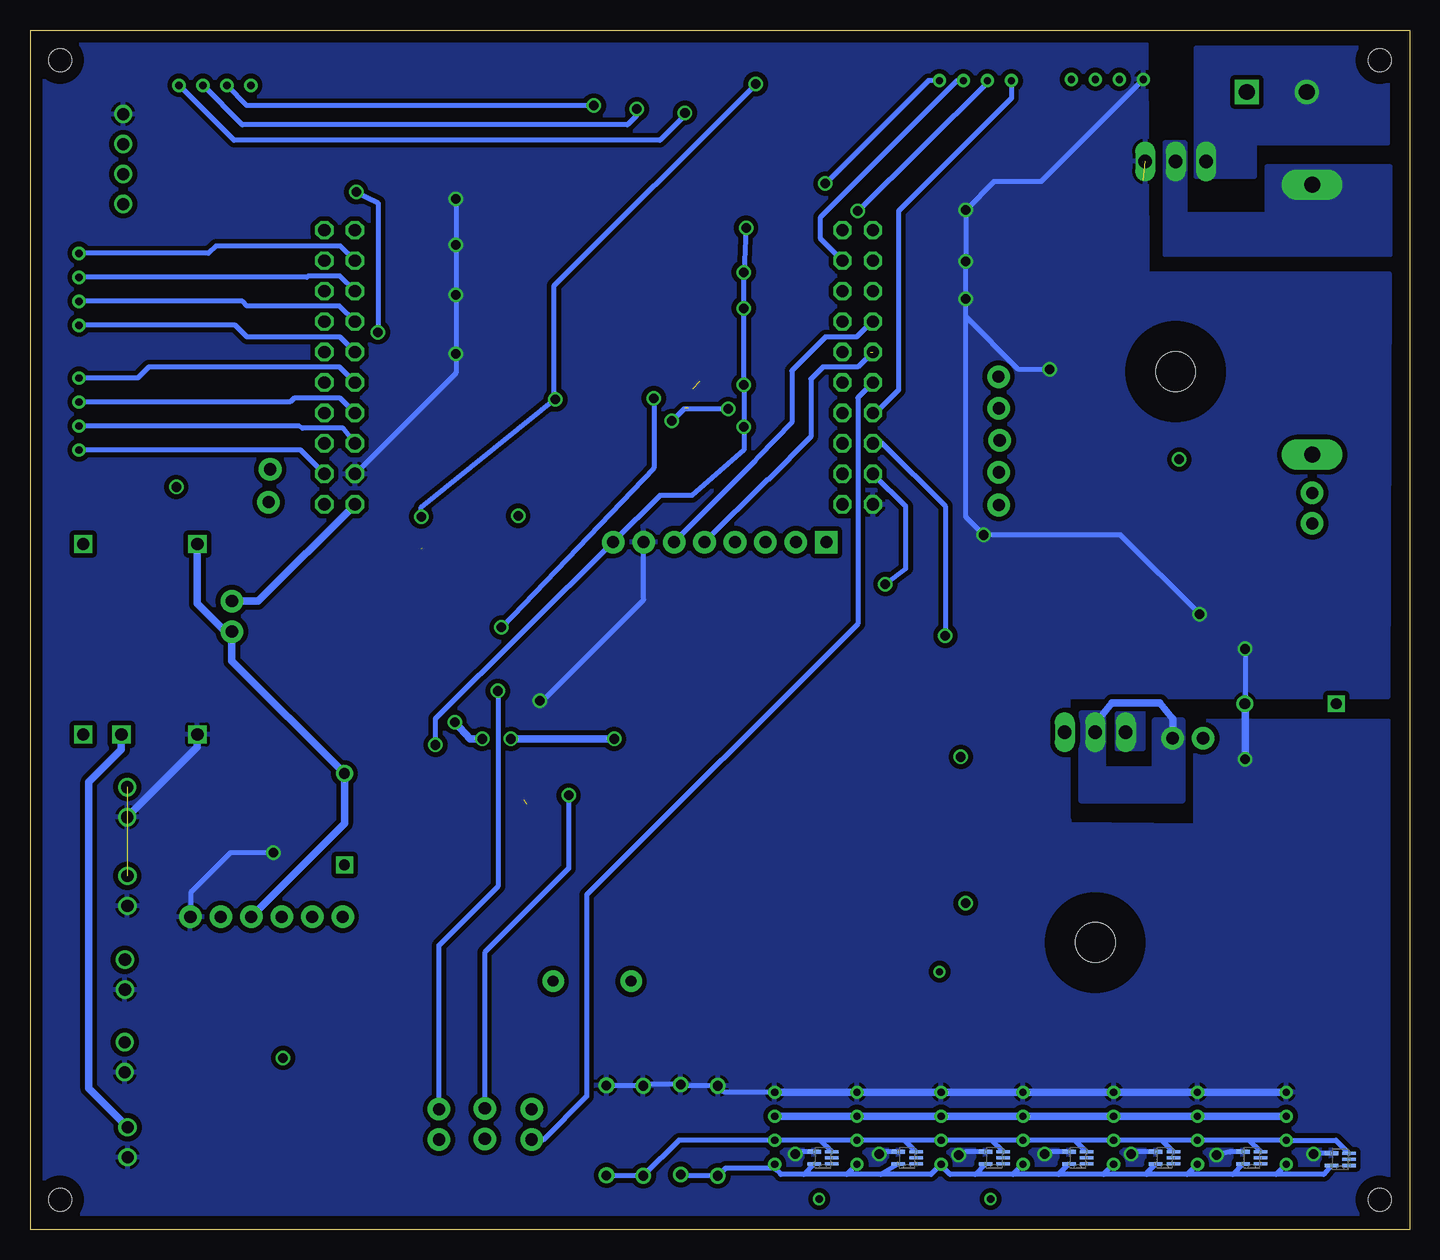
[diagram p11: board, bottom side, seen from below]

Size 115 x 100 mm. Coordinates in mm from the lower left corner, seen from the top.
Outline: 0,0 115,0 115,100 0,100 0,0
Copper layers (1*16): Top 0.035mm / dielectric 1.5mm / Bottom 0.035mm
Design rules "default *": minimum track width 0.4mm, minimum drill 0.8mm, track to track 0.4mm, track to pad 8mil, pad to pad 8mil, via to via 8mil, smd to smd 8mil, copper to edge 40mil, drill to drill 0.8mm, minimum pad ring 10mil, minimum via ring 8mil, stop-mask expansion 4mil, vias tented up to drill 0mil, thermal gap 10mil
Holes 1.9 mm at 2.5,97.5 112.5,97.5 2.5,2.5 112.5,2.5

### Footprints (pad centres in the part's own frame; a part is rotated, then mirrored left to right if it is on the bottom)
DO41-3 = drill 0.9: A 3.81,0 | drill 0.9 square: C -3.81,0
2PINRIGHT = drill 1.02: P$1 0,0; P$2 2.5,0
SH22,5 = drill 1.321 pad 2.54 long: 1 -11.252,0; 2 11.252,0
BUZZER-12MM = drill 0.9 pad 1.778: + 3.25,0; - -3.25,0
PANASONIC_G = smd 3.9 x 1.6: + 4.25,0; - -4.25,0
C1206 = smd 1.6 x 1.8: 1 -1.4,0; 2 1.4,0
PANASONIC_C = smd 2.6 x 1.4: + 2.05,0; - -2.05,0
PANASONIC_E = smd 3.8 x 1.4: + 3,0; - -3,0
PANASONIC_A = smd 2 x 1.5: + 1.3,0; - -1.3,0
B4B-ZR = drill 0.6: 1 6.08,0.88; 2 4.08,0.88; 3 2.08,0.88; 4 0.08,0.88
1X06_LOCK = drill 1.016 pad 1.88: 1 0,0; 2 2.54,0; 3 5.08,0; 4 7.62,0; 5 10.16,0; 6 12.7,0
SOT223 = smd 1.219 x 2.235: 1 -2.311,-3.099; 2 0,-3.099; 3 2.311,-3.099 | smd 3.6 x 2.2: 4 0,3.099
1X08 = drill 1.016 pad 1.88 square: 1 0,0 | drill 1.016 pad 1.88: 2 2.54,0; 3 5.08,0; 4 7.62,0; 5 10.16,0; 6 12.7,0; 7 15.24,0; 8 17.78,0
CHIPLED_1206 = smd 1.5 x 1.5: A 0,-1.75; C 0,1.75
RGBLED5050 = smd 2 x 1.1: 1 -2,1.7; 2 -2,0; 3 -2,-1.7; 4 2,-1.7; 5 2,0; 6 2,1.7
4PINRIGHT = drill 1.02: P$1 0,0; P$2 2.5,0; P$3 5,0; P$4 7.5,0
SCREWTERMINAL-5MM-2 = drill 1.3 pad 2.032 square: 1 0,0 | drill 1.3 pad 2.032: 2 5,0
1X01 = drill 1.016 pad 1.88: 1 0,0
1X02 = drill 1.016 pad 1.88: 1 0,0; 2 2.54,0
SOT23 = smd 1 x 1.4: 1 -0.95,-1.1; 2 0.95,-1.1; 3 0,1.1
TO220 = drill 1.118 long: 1 -2.54,-6.35; 2 0,-6.35; 3 2.54,-6.35 | hole 3.302: 0,11.176
R0805 = smd 1.3 x 1.5: 1 -0.85,0; 2 0.85,0
SOT23-BEC = smd 1 x 1.4: B -0.95,-1.1; C 0,1.1; E 0.95,-1.1
SOT50P160X60-5N = smd 1.118 x 0.254: 1 -0.737,0.508; 2 -0.737,0; 3 -0.737,-0.508 | smd 1.118 x 0.305: 4 0.737,-0.508; 5 0.737,0.508
TIVA = drill 1.02 octagon: P$1 0,0; P$2 2.54,0; P$3 5.08,0; P$4 7.62,0; P$5 10.16,0; P$6 12.7,0; P$7 15.24,0; P$8 17.78,0; P$9 20.32,0; P$10 22.86,0; P$11 0,2.54; P$12 2.54,2.54; P$13 5.08,2.54; P$14 7.62,2.54; P$15 10.16,2.54; P$16 12.7,2.54; P$17 15.24,2.54; P$18 17.78,2.54; P$19 20.32,2.54; P$20 22.86,2.54; P$21 0,43.18; P$22 2.54,43.18; P$23 5.08,43.18; P$24 7.62,43.18; P$25 10.16,43.18; P$26 12.7,43.18; P$27 15.24,43.18; P$28 17.78,43.18; P$29 20.32,43.18; P$30 22.86,43.18; P$31 0,45.72; P$32 2.54,45.72; P$33 5.08,45.72; P$34 7.62,45.72; P$35 10.16,45.72; P$36 12.7,45.72; P$37 15.24,45.72; P$38 17.78,45.72; P$39 20.32,45.72; P$40 22.86,45.72
PTN78000W = drill 1.02 square: P1 1.52,11.045; P2 1.52,4.705; P3 1.52,1.525; P4 17.4,1.52; P5 17.4,11.045
V18ZA2P = drill 0.8: P$1 0,0; P$2 7.5,0

### Placement (x,y rotation side)
1N4742  9.92,43.84 0 top
3.3V1  106.9,36.88 270 top
3.3VL  107.09,22.49 270 top
3.3VR  106.88,29.48 270 top
5V1  107.11,15.61 270 top
20A  8.11,75.85 270 top
BUZZER  68.14,20.7 0 top
C1  10.04,51.28 180 top
C2  100.66,79.5 90 top
C3  100.66,74.04 90 top
C4  100.66,68.14 270 top
C8  103.02,7.09 270 top
C9  73.36,33.83 90 top
C10  92.68,33.97 270 top
C11  107.39,47.32 90 top
C12  99.16,34.3 180 top
C13  20.53,16.69 90 top
C14  27.46,16.64 90 top
C15  34.61,16.64 90 top
C16  41.56,16.53 90 top
C17  49.08,16.63 90 top
C18  55.81,16.79 90 top
C19  13.65,16.61 90 top
C20  9.97,25.14 180 top
C21  9.89,36.49 180 top
C30  80.92,56.83 180 top
C31  80.99,52.04 180 top
C32  81.15,45.81 0 top
C33  59.59,83.82 0 top
C34  59.59,80.45 0 top
C35  59.78,76.64 0 top
C36  59.73,73.19 0 top
CON1  9.4,11.53 270 top
CON2  16.8,11.53 270 top
CON3  23.78,11.53 270 top
CON4  31.34,11.53 270 top
CON5  38.16,11.53 270 top
CON6  45.18,11.53 270 top
CON7  52.04,11.53 270 top
D2  88.78,34.2 90 top
FITPC  106.86,8.52 270 top
FORCE_L  111.8,75.3 90 top
FORCE_R  111.8,64.9 90 top
FTDI  88.93,26.07 0 top
IC5  81.56,35.43 90 top
IMU  48.61,57.3 0 top
L1  20.8,61.7 270 top
L2  52.5,25.53 90 top
L3  47.5,22.29 90 top
L4  58.65,96.4 180 top
L5  62.65,96.4 180 top
L6  66.26,96.43 180 top
L7  69.89,96.4 180 top
LED2  31.13,89.11 180 top
LEDS  96.5,94.5 0 top
LIPO_FB  107.23,92.99 270 top
LIPO_INPUT  13.56,94.83 180 top
P3  95.11,60.64 0 top
P4  94.98,63.37 0 top
P21  34.23,60.4 0 top
P22  34.23,63.13 0 top
P23  34.17,65.79 0 top
P26  34.23,68.46 0 top
P27  34.26,71.1 0 top
PWR_SW  8.11,61.4 270 top
Q1  60.21,65.61 270 top
Q2  61.12,61.34 180 top
Q3  19.5,82.7 180 top
Q5  59.15,69.62 0 top
Q6  26.2,35.1 180 top
R1  19.03,56.93 270 top
R2  104.66,78.87 270 top
R3  96.41,78.74 90 top
R4  104.73,73.85 90 top
R5  96.41,73.72 270 top
R6  104.73,68.14 270 top
R7  96.73,67.82 90 top
R8  33.6,47.4 0 top
R9  101.12,51.27 90 top
R10  53,70.22 0 top
R11  64.71,69.25 270 top
R12  53,66.78 0 top
R13  64.68,64.71 90 top
R14  59.74,25.53 180 top
R15  54.9,22.29 180 top
R16  58.62,90.27 90 top
R17  83.65,73.24 180 top
R18  62.69,90.31 90 top
R19  83.62,77.26 180 top
R20  66.07,90.34 90 top
R21  83.49,80.91 180 top
R22  69.73,90.31 90 top
R23  83.41,84.65 180 top
R24  52.86,63.69 180 top
R25  52.93,83.76 0 top
R26  52.8,79.95 0 top
R27  52.8,76.83 0 top
R28  52.9,73.56 0 top
R29  39.92,76.78 180 top
R30  28.78,75.58 0 top
R31  39.96,79.9 180 top
R32  28.59,79.77 180 top
R33  39.96,83.2 180 top
R34  28.59,83.96 180 top
R35  23.4,46.4 0 top
RGB  22.1,95 0 top
RST  73.18,7.49 90 top
RX  80.9,10.03 270 top
SW  33.1,94.9 0 top
T1  33.86,84.03 90 top
T2  34.18,79.77 90 top
T3  34.37,75.45 90 top
T4  76.84,76.98 90 top
T5  76.85,72.82 90 top
T6  76.7,85.69 90 top
T7  76.81,81.55 90 top
T8  28.8,46.4 180 top
TX  77.09,10.1 270 top
TX1  19.75,40.96 180 top
U1  48.9,5.97 180 bottom
U2  41.88,5.97 180 bottom
U3  34.61,5.97 180 bottom
U4  27.65,5.97 180 bottom
U5  20.42,5.97 180 bottom
U6  13.14,5.97 180 bottom
U7  5.78,5.84 180 bottom
U$1  90.45,60.45 90 top
U$4  112.09,39.75 90 top
V8ZA2P-1  60.75,12.08 270 top
V8ZA2P-2  66.94,12.01 270 top
V8ZA2P-3  57.66,4.48 90 top
V8ZA2P-4  63.88,4.48 90 top
VBUS  98.17,49.85 90 top

### Tracks (layer width: path | path; a pad name or v marks a point on that pad's centre or on a via)
3.3V  (via drill 0.8)  (1 unrouted)
  Top 0.406: R25.2 53.92,83.9 54.9,83.9 v55.3,83.5 | v55.5,79.8 55.65,79.95 R26.2 | R27.2 53.68,76.8 | 53.68,76.8 v55.5,76.8 | 53.68,76.8 53.75,76.73 R28.2 54.21,73.1 | R12.2 53.93,66.6 54.23,66.9 v55.5,66.9 55.84,66.56 Q1.1 58.2,67.47 Q5.1 | IC5.3 83.46,37.74 v81.2,40.4 | R10.2 55.02,70.22 v55.5,70.4
  Top 0.61: 3.3VR.P$1 108.5,27.86 108.5,24.3 107.09,22.89 3.3VL.P$1 | 3.3V1.P$1 92.78,36.88 92.6,36.7 | 92.1,35.1 92.41,35.1 C10.1 92.6,35.45 92.6,36.7 | IC5.3 86.54,37.74 88,39.8 91.7,39.8 92.6,38 92.6,36.7
  Bottom 0.406: v55.3,83.5 v55.5,79.8 v55.5,76.8 v55.5,70.4 v55.5,66.9 55.5,65 59.8,61.2 62.49,61.2 IMU.8 81.2,42.59 v81.2,40.4
5V  (via drill 0.8)  (1 unrouted)
  Top 0.406: LED2.1 LED2.2 LED2.3 47.01,90.81 52.7,96.5 | 66.23,98.15 L6.A | 62.62,98.18 L5.A | R13.2 64.71,65.59 R11.2 69.8,68.4 v71.2,69.2 | 82.39,56.76 82.39,59.11 v82.38,59.43 | 69.64,97.9 L7.A | 69.74,98 L7.A | L5.A L4.A 54.35,98.15 52.7,96.5 | L5.A 62.69,98.18 L6.A | L6.A 66.29,98.15 L7.A | v54.5,95.5 53.7,95.5 52.7,96.5
  Top 0.61: 5V1.P$1 106.82,15.6 102.7,15.6 96.55,21.75 FTDI.4 96.55,28.3 | 96.55,28.3 96.55,33.91 C12.+ | 82.39,56.76 C31.1 87.3,52.05 89.5,49.85 | C32.+ 82.75,45.8 83.1,45.8 87.15,49.85 89.5,49.85 | 89.5,49.85 VBUS.1 | BUZZER.+ 79.2,20.7 87,28.5 96.35,28.5 96.55,28.3
  Bottom 0.406: v82.38,59.43 82.38,60.23 71.3,69.2 v71.2,69.2 71.3,69.3 71.3,78.7 v54.5,95.5
  Bottom 0.61: FTDI.4 88.78,33.83 D2.A 98.17,47.4 98.17,49.3 | VBUS.1 98.17,49.3 | U$4.P5 101.04,52.17 98.17,49.3
5VJ
  Bottom 0.61: VBUS.2 95.98,52.39 U$1.P$11
GND  (via drill 0.8)  (2 unrouted)
  Top 0.406: v8,6.3 8,10.37 CON1.4 | v16.1,6.2 16.1,10.67 CON2.4 | v23.2,6.3 23.2,10.59 CON3.4 | v30.4,6.3 30.4,10.63 CON4.4 | v37.6,6.2 37.6,10.5 CON5.4 | v44.2,6.3 44.2,10.48 CON6.4 | v51.2,6.3 51.2,10.43 CON7.4 | C19.2 14.3,18.01 20.44,18.01 C13.2 27.41,18.09 C14.2 C15.2 41.46,18.04 C16.2 48.99,17.93 C17.2 | C17.2 55.66,18.03 | 55.66,18.03 C18.2 | C17.2 49.08,18.95 L3.C 45.75,23.65 47.7,25.6 50.67,25.6 L2.C | C3.2 97.28,75.44 R5.1 93.67,74.57 93.5,74.4 89.5,74.4 89.2,74.1 | R7.1 100.43,66.97 C4.2 | LIPO_FB.P$1 100.66,86.42 C2.2 97.72,80.9 R3.2 94.09,79.59 91.5,77 89.4,77 89.2,76.8 89.2,74.1 | C8.2 103.35,6.02 FITPC.P$2 | C12.- 103.56,32.9 104.8,32.9 | C10.2 93.85,31.4 v94.7,31.4 | T3.2 35.8,76.4 v37,77.6 | v37,80.7 35.3,80.7 T2.2 | v37,85 36.48,84.98 T1.2 34.96,85.36 | C33.2 C34.2 61.18,80.26 C35.2 61.13,76.59 C36.2 71.11,73.19 79.5,65.8 79.5,61.8 | Q2.2 53.24,62.44 49.6,58.8 | 49.6,58.8 46.39,58.8 U$1.P$31 42.18,57.9 v35.5,57.9 | 79.5,61.8 79.5,57.31 C30.2 73.8,51.12 73.8,44.1 | V8ZA2P-3.P$2 57.66,16.02 55.66,18.03 | R7.1 96.72,58.73 95.3,57.3 87.1,57.3 84.5,59.9 84.5,61.5 84.2,61.8 | U$1.P$12 86.72,61.8 84.2,61.8 | 84.2,61.8 79.5,61.8 | R7.1 95.43,66.97 93.1,69.3 89.3,69.3 89.2,69.4 89.2,74.1 | 73.8,44.1 73.8,35.8 | v72.5,44.1 73.8,44.1 | T6.2 78.77,86.64 v79.5,85.9 | T7.2 79.1,82.5 v79.5,82.1 | T4.2 79.47,77.93 v79.5,77.9 | T5.2 78.73,73.77 v79.5,73 | IMU.7 62.35,58.8 49.6,58.8 | L1.C 22.55,64.25 v30,71.7 | C1.- 14.31,51.3 v17.5,51.3 | 13.73,50.71 13.73,49.03 v13.7,48.4
  Top 0.61: C1.- 13.73,50.71 | 14.22,18.09 14.3,18.01 | FITPC.P$2 110,9.16 110,16 | 110,16 110,22.9 | 110,22.9 110,32.3 107.92,34.38 3.3V1.P$2 106.28,34.38 104.8,32.9 104.8,29.06 3.3VR.P$2 | 5V1.P$2 110,16 | 110,22.9 3.3VL.P$2 104.7,20 101.63,23.07 FTDI.6 | IC5.4 IC5.2 89.82,35.43 C10.2 | IC5.4 73.56,35.43 C9.2 | U$4.P1 101.12,41.35 R9.1 105.69,50.42 C11.2 | C30.2 79.59,56.76 C31.2 | C32.- 78.47,44.73 IC5.4 | LIPO_INPUT.1 14.61,95.88 19.4,95.88 | 19.4,95.88 RGB.4 | 22.18,87.49 22.18,93.1 19.4,95.88 | C19.2 12.97,18.69 C20.- 12.89,25.22 C21.- 13.7,37.3 v13.7,39.2
  Bottom 0.406: U7.4 7.95,6.35 v8,6.3 | U6.4 14.98,6.48 v16.1,6.2 | U5.4 22.88,6.48 v23.2,6.3 | U4.4 30.22,6.48 v30.4,6.3 | U3.4 37.02,6.48 v37.6,6.2 | U2.4 44.02,6.48 v44.2,6.3 | U1.4 50.82,6.48 v51.2,6.3 | V8ZA2P-2.P$1 66.9,11.98 V8ZA2P-4.P$2 63.77,12.08 V8ZA2P-1.P$1 60.64,11.98 V8ZA2P-3.P$2 57.13,11.45 CON7.4 | v94.7,31.4 98.3,31.4 101.6,28.1 101.6,26.1 FTDI.6 | 37,76.1 37,59.4 v35.5,57.9 24.1,57.9 v17.5,51.3 | 37,76.1 v37,77.6 v37,80.7 v37,85 34.61,87.39 30.67,87.39 RGB.4 | v72.5,44.1 72.25,44.1 63.85,52.5 IMU.7 | v79.5,85.9 v79.5,82.1 | v79.5,82.1 79.6,82 | v79.5,82.1 v79.5,77.9 v79.5,73 79.5,71.41 U$1.P$12 | v30,71.7 32.6,71.7 37,76.1 | v13.7,48.4 13.7,43.86 1N4742.A
  Bottom 0.61: CON1.4 CON2.4 CON3.4 CON4.4 CON5.4 CON6.4 CON7.4 | U$4.P1 101.04,40.23 3.3V1.P$2 | 1N4742.A 13.7,43.81 v13.7,39.2
  pour Top: 21.9,79.7 1.7,79.7 1.8,68.4 15.3,68.4 15.3,58.6 11.9,58.6 11.9,48 28.4,48 28.4,33.7 11.8,33.7 11.8,11.5 57.2,11.5 57.1,1.3 113.8,1.3 113.9,98.5 21.8,98.5 21.9,81.3
  pour Bottom: 17.8,33.7 17.8,42.4 1.8,42.4 1.8,1.3 114,1.3 114,98.9 22,98.9 21.9,79.7 1.7,79.7 1.8,44.4 28.5,44.4 28.5,34.2 28.4,34.2 28.4,33.8
HX_RX
  Top 0.406: R14.1 62.3,23.81 62.3,6.13 V8ZA2P-1.P$2 60.75,4.55 62.1,3.2 76.61,3.2 RX.2 94.01,20.61 FTDI.3
  Bottom 0.406: U7.5 7.15,4.6 11.12,4.6 | 10.28,5.38 CON1.1 11.12,4.6 | 11.12,4.6 14.74,4.6 | 14.74,4.6 18.52,4.6 | CON2.1 18.52,4.6 | 18.52,4.6 21.9,4.6 | 21.9,4.6 25.51,4.6 | 24.66,5.16 CON3.1 25.51,4.6 | 25.51,4.6 29.25,4.6 | 29.25,4.6 33.06,4.6 | 32.22,5.22 CON4.1 33.06,4.6 | 33.06,4.6 36.2,4.6 | 36.2,4.6 38.3,4.6 39.04,5.34 CON5.1 39.89,4.6 44.08,4.6 | 46.06,5.26 CON6.1 46.91,4.6 | 46.91,4.6 50.49,4.6 | 50.49,4.6 52.4,4.6 52.92,5.12 | 52.92,5.12 CON7.1 | U6.5 14.74,4.6 | U5.5 21.9,4.71 21.9,4.6 | U4.5 29.25,4.6 | U3.5 36.2,4.6 | U2.5 44.08,4.6 | U1.5 50.49,4.6 | 44.08,4.6 46.91,4.6 | 52.92,5.12 57.02,5.12 V8ZA2P-3.P$1 60.64,4.48 V8ZA2P-1.P$2
HX_TX
  Top 0.406: R15.1 59.2,18.83 59.2,9.3 57.34,7.45 CON7.2 | V8ZA2P-2.P$2 74.05,4.51 76.72,7.18 | 76.72,7.18 TX.2 | FTDI.2 79.2,13.79 79.2,9.8 76.72,7.32 76.72,7.18
  Bottom 0.406: U7.3 6.14,7.45 CON1.2 13.38,7.45 | U6.3 13.38,7.45 | 13.38,7.45 CON2.2 20.65,7.45 | U5.3 20.65,7.45 | 20.65,7.45 CON3.2 27.89,7.45 | U4.3 27.89,7.45 | 27.89,7.45 CON4.2 34.84,7.45 | U3.3 34.84,7.45 | 34.84,7.45 CON5.2 42.11,7.45 | U2.3 42.11,7.45 | 42.11,7.45 CON6.2 49.13,7.45 | U1.3 49.13,7.45 | 49.13,7.45 CON7.2 60.91,7.45 V8ZA2P-4.P$1 66.9,4.48 V8ZA2P-2.P$2
LIPO_FB4
  Top 0.406: LIPO_FB.P$4 107.3,85.42 107.3,68.9 105.69,67.28 R6.2
MOSFET_CTRL
  Bottom 0.61: TX1.1 19.75,42.55 20.8,43.9 24.8,43.9 26.2,42.2 Q6.2
  pour Top (no thermals): 19,42.4 21.2,42.4 21.2,38.3 25.6,38.3 25.6,43 27.3,43 27.3,35.8 19,35.8
  pour Bottom (no thermals): 19,42.4 21.2,42.4 21.2,38.3 25.6,38.3 25.6,43 27.3,43 27.3,35.8 19,35.8
MOSFET_CTRL1
  Top 0.61: CON1.3 13.65,12.81 C19.1 6.97,21.89 C20.+ 7.4,25.57 7.4,36.49 C21.+ 11.41,40.96 TX1.2 | C13.1 20.53,12.3 CON2.3 | C14.1 27.46,12.25 CON3.3 | C15.1 34.61,11.84 CON4.3 | C16.1 41.56,11.96 CON5.3 | C17.1 49.08,12.47 CON6.3 | C18.1 55.81,12.34 CON7.3
  Bottom 0.61: CON1.3 CON2.3 CON3.3 CON4.3 CON5.3 CON6.3 CON7.3
  pour Top (no thermals): 1.8,42.4 17.8,42.5 17.8,38.2 10,38.2 9.9,10 55.4,10 55.4,1.3 1.7,1.1 1.8,18
N$1
  Top 0.406: R30.1 25,78.51 25,88.2 27.61,90.81 | LED2.4 27.61,90.81 | RGB.3 27.61,92.45 27.61,90.81
N$2
  Top 0.406: RST.2 88.93,25.78 FTDI.1
N$3
  Top 0.61: C9.1 83.97,32.43 IC5.1 86.05,33.12 D2.C
N$4
  Top 0.406: R2.1 104.66,87.92 LIPO_FB.P$2
N$5
  Top 0.406: R32.2 26.1,81.41 26.1,87 28.21,89.11 LED2.5 29.9,89.1 29.9,89.4 30.7,90.2 30.7,91.36 RGB.2
N$6  (via drill 0.6)
  other vias: 49.21,2.54
N$7  (via drill 0.6)
  other vias: 39.18,21.49
N$8  (via drill 0.6)
  other vias: 34.92,2.54
N$9
  Top 0.61: 20A.2 PWR_SW.1
  pour Top (no thermals): 1.9,66.3 13.5,66.3 13.5,60.6 1.9,60.6
N$10
  Top 0.61: Q3.2 19.5,87.3 18.8,86.6 8.62,86.6 20A.1
  pour Top (no thermals): 1.6,88.6 11.9,88.6 11.9,84.6 18.7,84.6 18.7,90.6 20.4,90.6 20.4,81.3 1.6,81.3
  pour Bottom (no thermals): 1.6,88.6 11.9,88.6 11.9,84.6 18.7,84.6 18.7,90.6 20.4,90.6 20.4,81.3 1.6,81.3
N$14  (via drill 0.8)
  other vias: 37.4,39.4
N$16  (via drill 0.8)
  other vias: 37,27.2
N$17  (via drill 0.8)
  other vias: 74.3,59.5
N$18
  Top 0.61: Q3.3 14.35,89.05 LIPO_INPUT.2
  pour Top (no thermals): 1.8,98.5 17.8,98.5 17.8,87.8 12.9,87.8 12.9,90.6 1.8,90.6
  pour Bottom (no thermals): 1.8,98.5 17.8,98.5 17.8,87.8 12.9,87.8 12.9,90.6 1.8,90.6
N$19
  Top 0.406: Q6.1 28.74,45.24 T8.C 25.35,45.3 R35.2
N$20
  Top 0.406: Q2.3 67.56,60.24 69.9,57.9 69.9,47.6 68.1,45.8 68.1,23 65.8,20.7 BUZZER.-
N$21
  Top 0.406: Q2.1 60.82,63.69 R24.1
N$22
  Top 0.406: T4.1 81.54,76.03 R19.2
N$24  (via drill 0.8)
  Top 0.406: L5.C 62.69,94.62 | 62.69,94.62 R18.2 | 62.69,94.62 63.18,94.62 v64.4,93.4
  Bottom 0.406: v64.4,93.4 64.4,92.9 65.2,92.1 97.3,92.1 LEDS.2
N$25
  Top 0.406: R18.1 75.16,76.98 T4.3
N$26
  Top 0.406: T5.1 81.43,71.87 R17.2
N$27
  Top 0.406: R34.2 27.74,86.02 LED2.6 29.71,87.41 29.8,87.5 30.8,87.5 31.7,88.2 31.7,92.56 RGB.1
N$28
  Top 0.61: T8.B 32.45,47.5 R8.1
N$29
  Top 0.406: R30.2 33.14,75.58 T3.3
N$30
  Top 0.406: R32.1 T2.3
N$31
  Top 0.406: R34.1 32.7,83.96 T1.3
N$32  (via drill 0.8)
  Top 0.406: R16.2 58.62,94.62 L4.C 58.85,94.65 v60.4,93.1
  Bottom 0.406: v60.4,93.1 60.4,92.9 62.5,90.8 98,90.8 LEDS.1
N$33
  Top 0.406: R16.1 75.23,72.82 T5.3
N$34  (via drill 0.8)
  other vias: 102.8,61.9
N$35  (via drill 0.8)
  other vias: 93.9,14.3
N$36
  Top 0.406: T6.1 77.89,84.65 R23.2
N$37
  Top 0.406: T3.1 37.99,74.5 R29.2
N$38
  Top 0.406: T2.1 38.03,78.82 R31.2
N$39
  Top 0.406: T1.1 38.98,83.08 R33.2
N$40
  Top 0.406: R22.2 69.73,94.49 L7.C 95.85,94.65 LEDS.4
N$41
  Top 0.406: R22.1 73.5,85.69 T6.3
N$42
  Top 0.406: T7.1 78.42,80.91 R21.2
N$43  (via drill 0.8)
  Top 0.406: R20.2 66.07,94.49 L6.C 67.02,94.68 v68,93.7
  Bottom 0.406: v68,93.7 96.9,93.7 LEDS.3
N$44
  Top 0.406: R20.1 74.01,81.55 T7.3
N$45  (via drill 0.8)
  other vias: 19.2,64.2
N$73
  Top 0.406: R14.2 L2.A
N$74
  Top 0.406: R15.2 L3.A
N$76
  Top 0.61: U$4.P4 105.54,52.12 R9.2
N$338
  Top 0.406: LIPO_FB.P$3 106.99,87.99 105.8,86.8 105.8,82.5 106.3,82 106.3,76.27 R4.2
N$381
  Top 0.61: R1.1 19.05,57.8 L1.A
P2
  Bottom 0.406: U$1.P$2 92.44,64.98 FORCE_R.4
P3
  Top 0.61: U$1.P$3 90.45,65.29 P3.1
P4
  Top 0.61: U$1.P$4 90.45,67.9 P4.1
P5
  Top 0.406: U$1.P$5 94.78,70.61 R7.2 97.59,69.53 C4.1 101.21,68.99 R6.1
P6
  Top 0.406: U$1.P$6 96.13,73.15 R5.2 100.43,72.87 C3.1 104.37,72.64 R4.1
P7
  Top 0.406: U$1.P$7 94.21,75.69 R3.1 100.45,77.89 C2.1 100.8,77.97 104.61,77.97 R2.2
P8  (via drill 0.8)
  Top 0.406: U$1.P$8 92.4,80.18 92.4,85.5 91.4,86.5 v87.8,86.5 | v86,74.8 84.5,73.4 R17.1
  Bottom 0.406: v87.8,86.5 86,85.6 v86,74.8
P9
  Top 0.406: R19.1 86.71,79.5 89.7,79.5 90.45,80.25 U$1.P$9
P10
  Top 0.406: R21.1 85.43,82 89.8,82 90.45,82.66 U$1.P$10
P13
  Bottom 0.406: U$1.P$13 88.88,66.8 92.3,66.8 92.58,66.98 FORCE_R.3
P14
  Bottom 0.406: U$1.P$14 89.14,69.3 93,69.3 93.32,68.98 FORCE_R.2
P15
  Bottom 0.406: U$1.P$15 89.2,71.9 105.1,71.9 106.02,70.98 FORCE_R.1
P16
  Bottom 0.406: U$1.P$16 89.16,74.4 96.9,74.4 97.88,75.38 FORCE_L.4
P17
  Bottom 0.406: U$1.P$17 89.22,77 96.9,77 97.28,77.38 FORCE_L.3
P18
  Bottom 0.406: U$1.P$18 89.18,79.5 91.8,79.5 91.92,79.38 FORCE_L.2
P19
  Bottom 0.406: U$1.P$19 89.14,82 99.5,82 100.12,81.38 FORCE_L.1
P20
  Top 0.406: R23.1 85.59,83.31 U$1.P$20
P21
  Top 0.406: P21.1 42.5,60.4 43.8,61.7 46.33,61.7 47.27,60.75 U$1.P$21
P22
  Top 0.406: P22.1 42.43,63.23 43.5,64.3 46.07,64.3 U$1.P$22
P23
  Top 0.406: R24.2 50.17,65.53 U$1.P$23 46.01,66.8 43.5,66.8 42.49,65.79 P23.1
P24
  Top 0.406: U$1.P$24 48.57,66.78 R12.1 52.15,65.85 52.28,65.62 56.08,65.62 57.1,64.6 59.04,64.6 Q1.2
P25  (via drill 0.8)  (1 unrouted)
  Top 0.406: U$1.P$25 51.77,70.61 R10.1 52.15,69.25 53,68.4 v56.8,68.4 | v61.5,67.4 60.38,68.52
  Bottom 0.406: v56.8,68.4 60.5,68.4 v61.5,67.4
P28  (via drill 0.8)
  Top 0.406: C35.1 56.53,78.5 52.8,78.5 51.95,77.65 R27.1 48.67,76.83 U$1.P$28 46,79.6 v46,84.9
  Bottom 0.406: SW.3 35.18,95.62 v46,84.9
P29
  Top 0.406: U$1.P$29 48.1,79.95 R26.1 51.95,80.35 53.4,81.8 56.85,81.8 C34.1
  Bottom 0.406: U$1.P$29 49.1,82.6 49.1,84.4 37.72,95.78 SW.2
P30  (via drill 0.8)
  Top 0.406: U$1.P$30 51.63,83.31 R25.1 51.64,83.76 52,84.12 52,85.85 | C33.1 58.19,83.91 56.25,85.85 53.7,85.85 | 53.7,85.82 53.7,85.85 | v48.7,87.2 50.05,85.85 52,85.85 | 52,85.85 53.7,85.85
  Bottom 0.406: SW.1 40.12,95.78 v48.7,87.2
P32  (via drill 0.8)
  Top 0.406: v43.7,53.8 47.7,53.8 48.6,54.8 48.61,54.81 IMU.1
  Bottom 0.406: U$1.P$32 42,60.26 42,55.1 v43.7,53.8 | IMU.1
P33  (via drill 0.8)
  Top 0.406: R8.2 36.3,47.4 v38.7,49.5
  Bottom 0.406: v38.7,49.5 38.7,60.3 43.93,65.53 U$1.P$33
P34
  Top 0.406: C36.1 56.94,71.8 53.1,71.8 52.05,72.85 | 52.05,72.85 R28.1 | 52.05,72.85 51.1,71.9 46.1,71.9 46,71.7 46,69 44.97,68.07 U$1.P$34
  Bottom 0.406: U$1.P$34 44.53,68.07 42.6,70 42.6,84.9 33.18,94.32 SW.4
P35
  Bottom 0.406: U$1.P$35 46,69.35 46,50.5 68.6,27.9 68.6,11.1 72.21,7.49 RST.1
P36  (1 unrouted)
  Bottom 0.406: 44.95,73.15 44.95,72.95 46,71.9 48.9,71.9 49.9,70.9 49.9,66.1 53.5,62.5 53.57,62.5 IMU.5
P37
  Bottom 0.406: U$1.P$37 44.81,75.69 46.1,74.4 48.7,74.4 51.5,71.6 51.5,67.3 54.3,64.4 54.6,64.01 IMU.6
P38
  Top 0.406: R29.1 42.22,78.23 U$1.P$38
P39
  Top 0.406: R31.1 43.86,79.9 U$1.P$39
P40
  Top 0.406: R33.1 44.62,83.2 U$1.P$40
RX3
  Top 0.406: P26.1 37.76,68.46 43.7,74.4 46.03,74.4 U$1.P$26
TIVA_RX  (via drill 0.8)
  Top 0.406: v70.1,36.2 71.3,37.4 71.3,61.8 69.25,63.85 R13.1 63.07,63.85 Q1.3
  Bottom 0.406: v70.1,36.2 70.1,30.1 77.1,23.1 77.1,11.01 TX.1
TIVA_TX  (via drill 0.8)  (1 unrouted)
  Top 0.406: v75.7,50.2 75.7,45 v76,44.9 | R11.1 63,70.1 | 63,70.1 59.75,70.1 | v63,69.3 63,70.1
  Bottom 0.406: v63,69.3 63,63.5 v75.7,50.2 | v76,44.9 76,28.6 80.9,23.7 RX.1
TX3
  Top 0.406: U$1.P$27 46.07,77 44,77 38,71.1 P27.1
VCC  (via drill 0.8)
  Top 0.406: R35.1 22.55,42.56 Q6.3
  Top 0.61: PWR_SW.2 8.11,53.6 | 8.11,53.6 C1.+ 5.79,44.15 1N4742.C | C8.1 103.05,8.52 FITPC.P$1 | C11.1 U$4.P2 105.01,38.9 96.7,38.9 93.3,42.3 v79.6,42.3 | v66.3,40.9 63.1,40.9 59.9,37.7 24.5,37.7 23.66,38.54 Q6.3 | v74.9,40.9 v77.3,40.9 | 8.11,53.6 16.55,53.6 R1.2 22.55,52.56 R35.1
  Bottom 0.61: FITPC.P$1 110.1,11.76 110.1,37.3 107.38,40.02 U$4.P2 | v66.3,40.9 v74.9,40.9 | v77.3,40.9 78.3,40.9 v79.6,42.3
  pour Top (no thermals): 1.8,59.5 10,59.5 10,45.8 24.4,45.8 24.4,40.1 22.2,40.1 22.2,43.5 1.8,43.5
  pour Bottom (no thermals): 22.2,43.2 24.4,43.2 24.4,40.1 22.2,40.1

### Text on the board
tPlace: IVLABS | VERSION-1.0